# Altium schematic sheet cricket-node-hw--top-level_B.SchDoc
size D; SheetNumber: 1; SheetTotal: 1
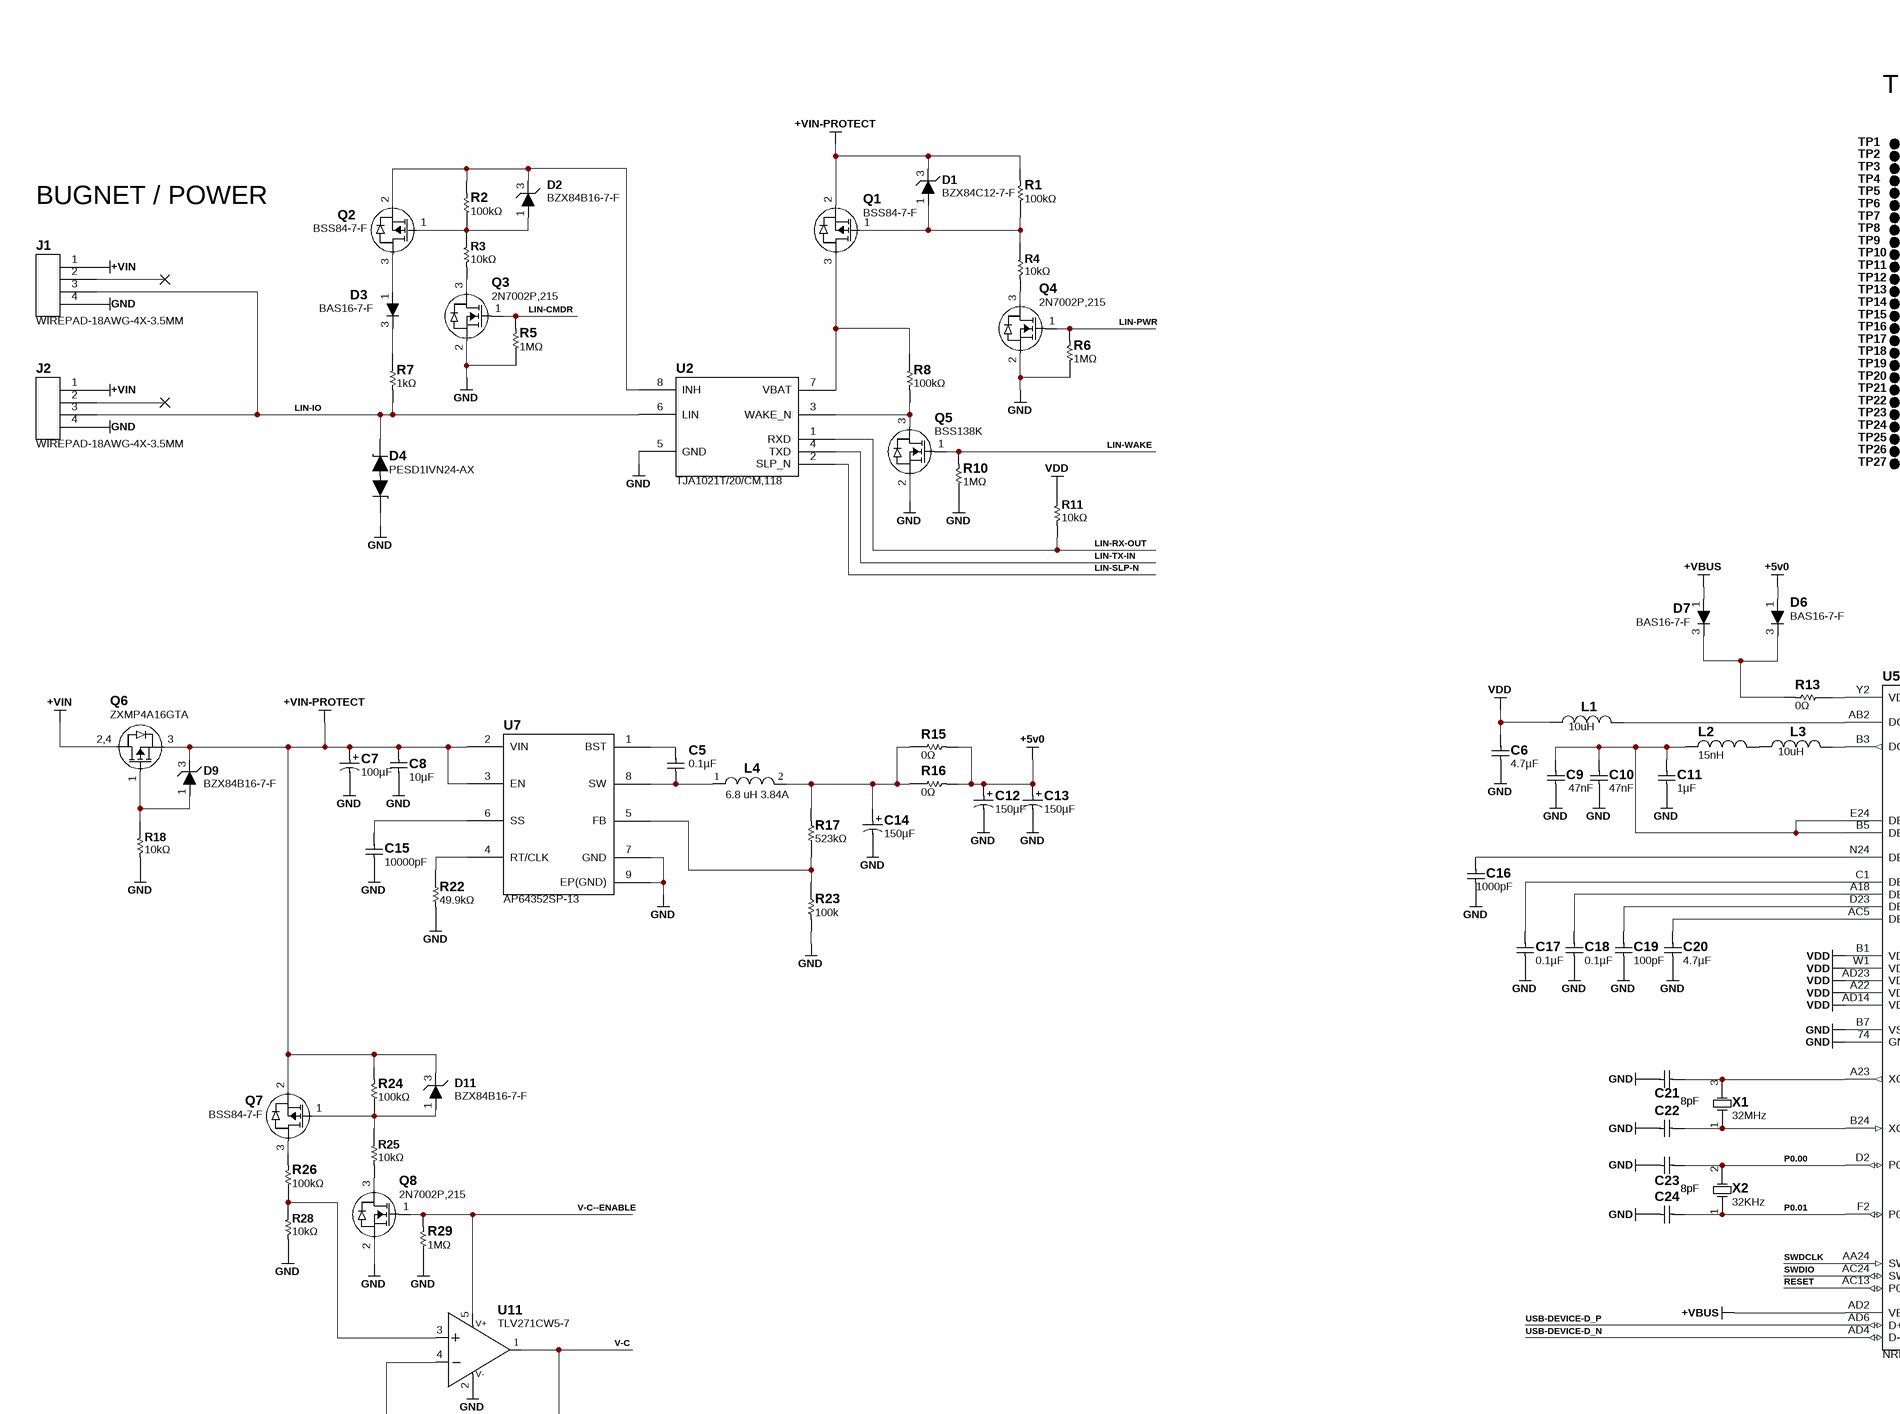
[diagram p0: cricket-node-hw--top-level_B.SchDoc, top left]
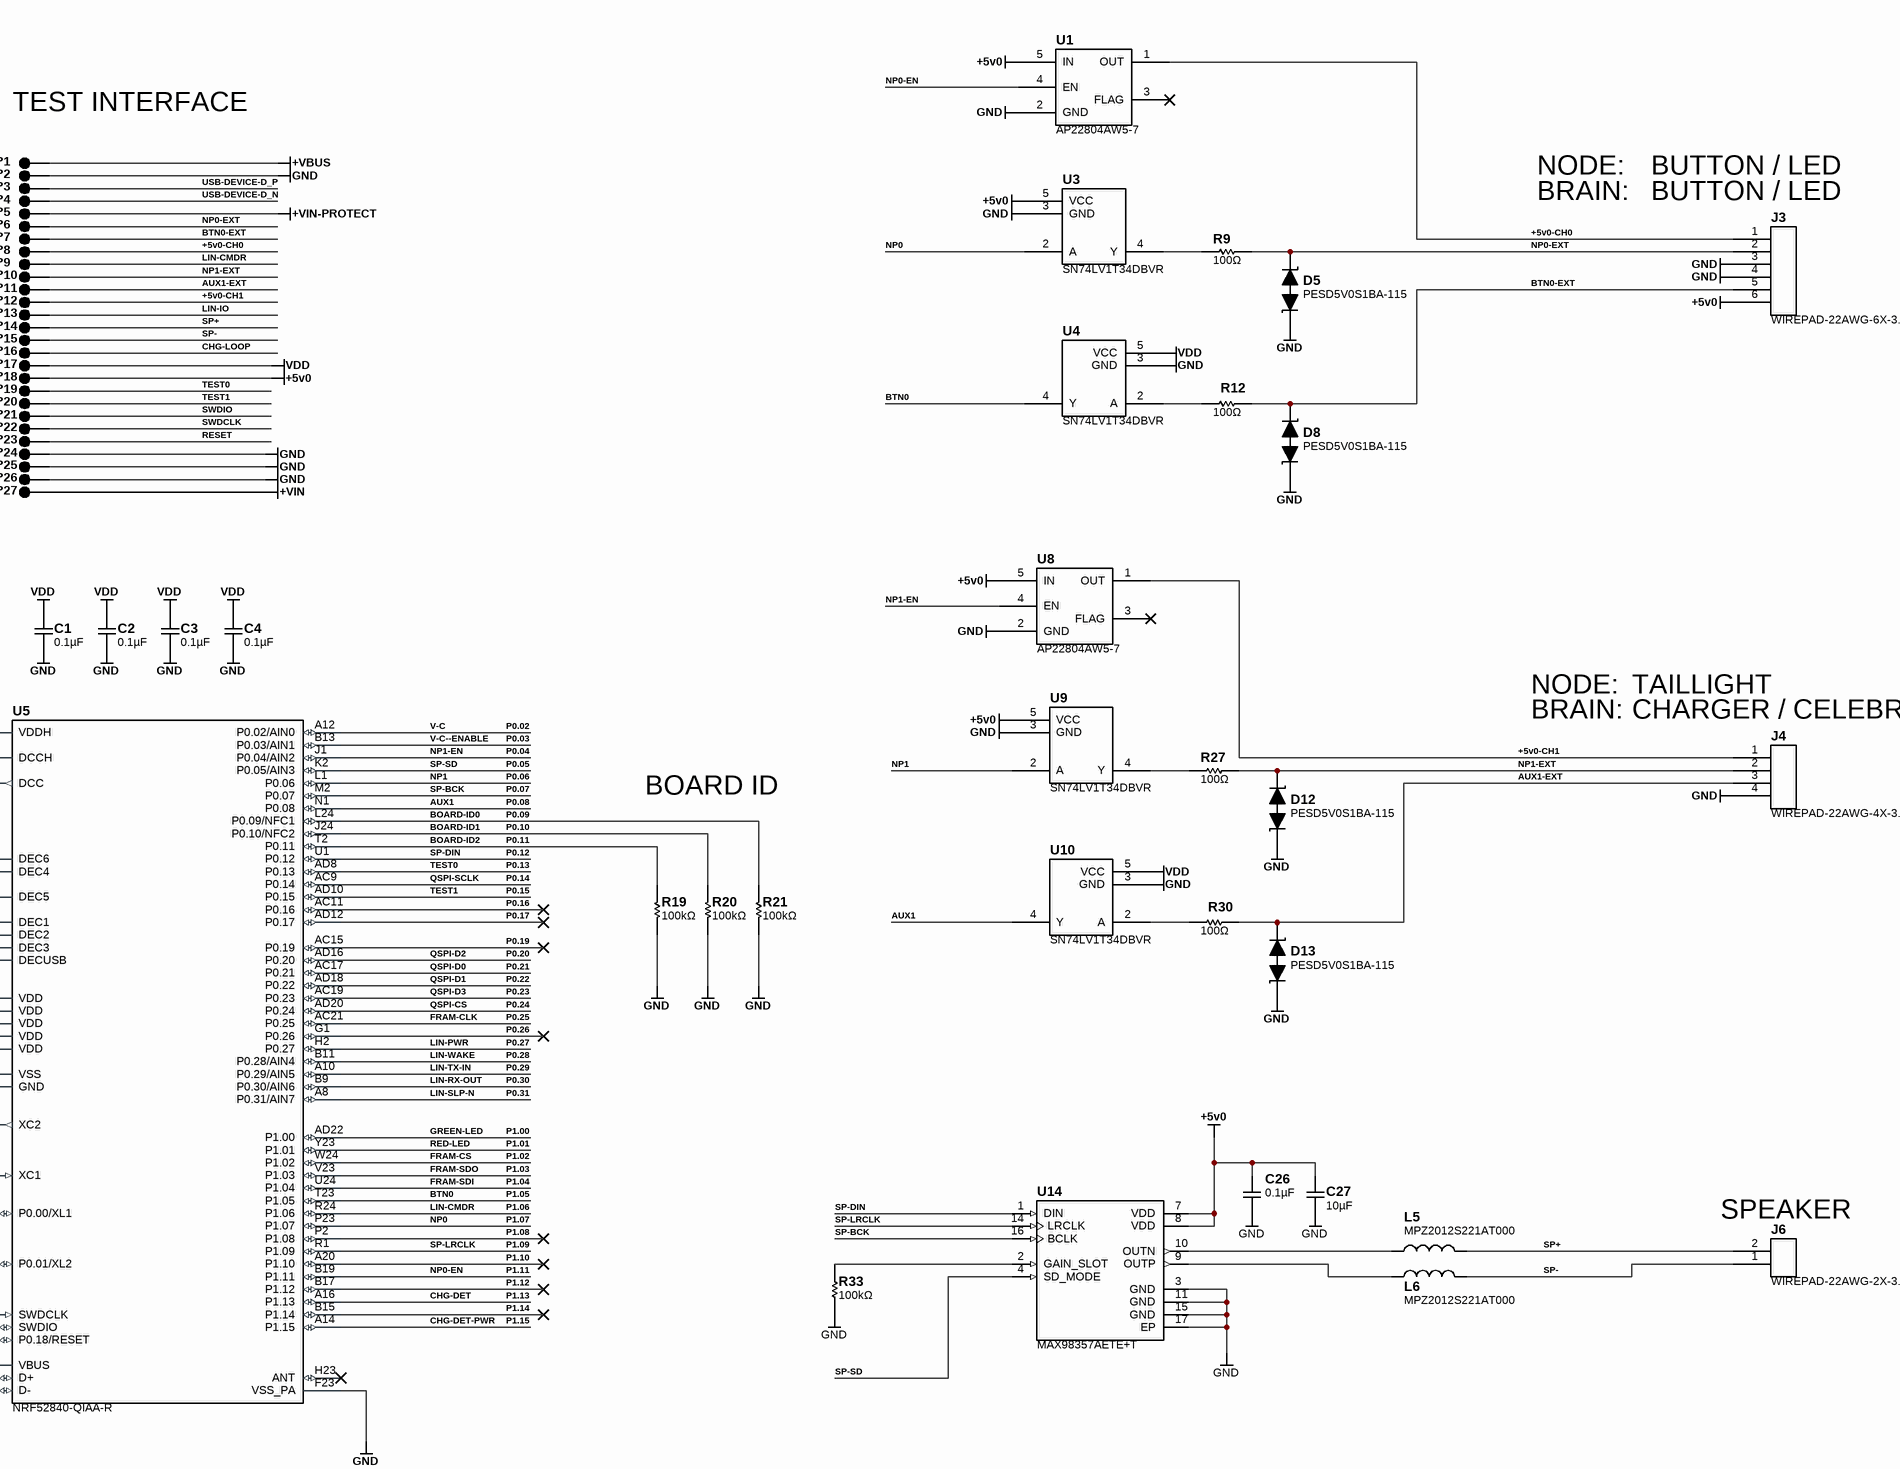
[diagram p1: cricket-node-hw--top-level_B.SchDoc, top right]
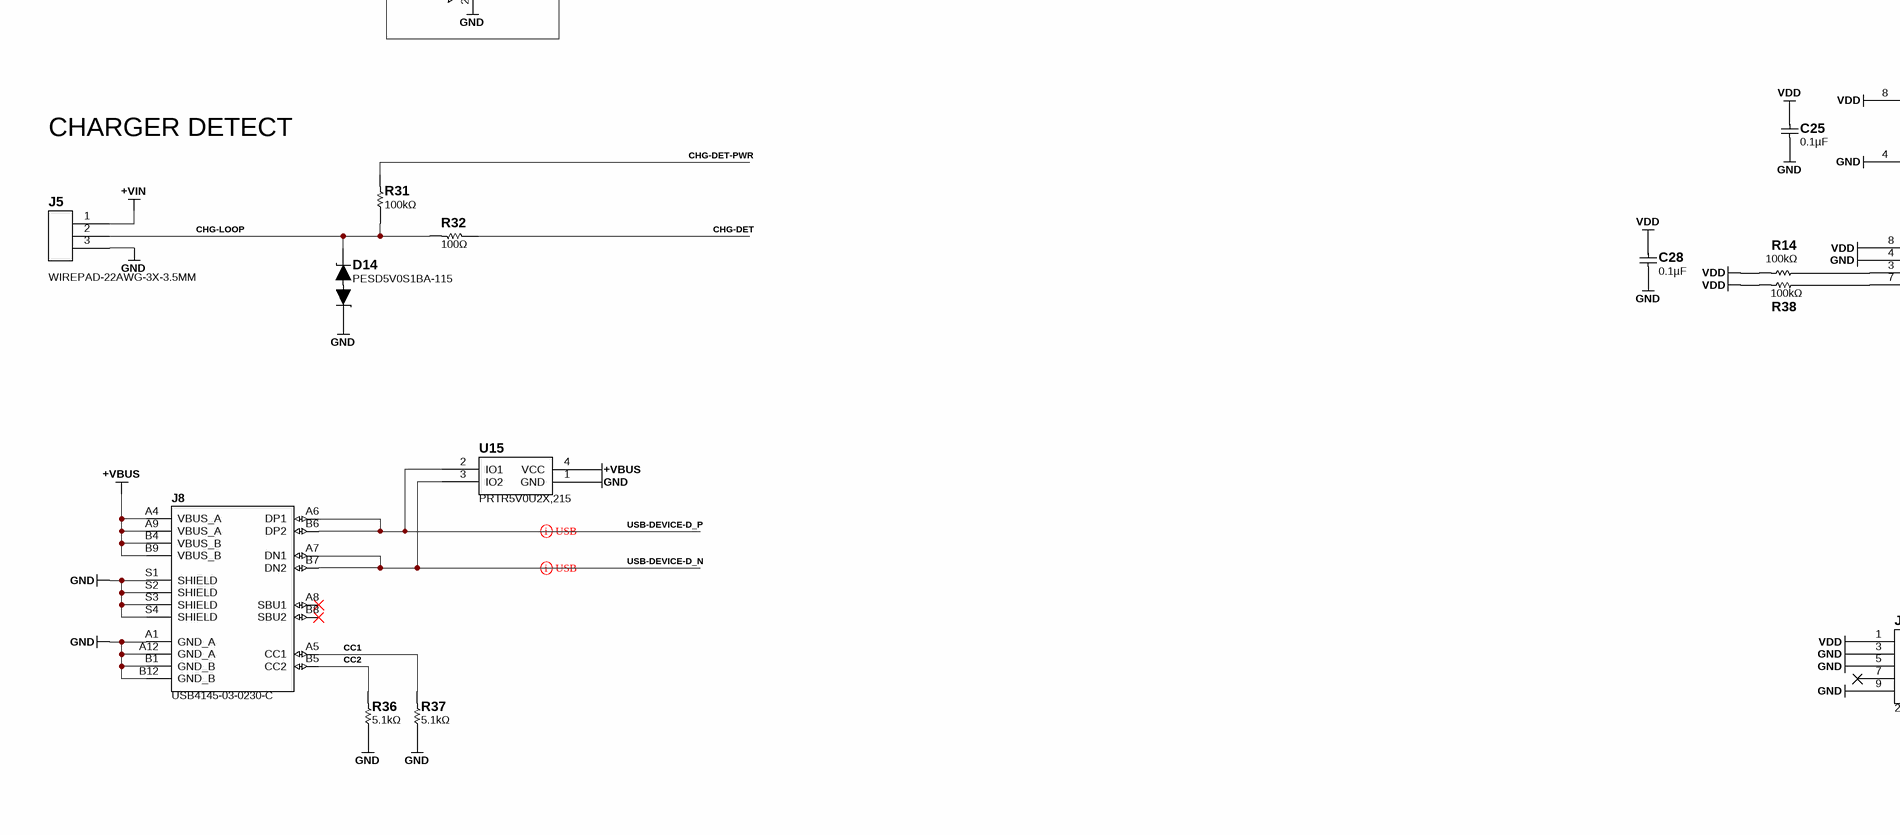
[diagram p2: cricket-node-hw--top-level_B.SchDoc, bottom left]
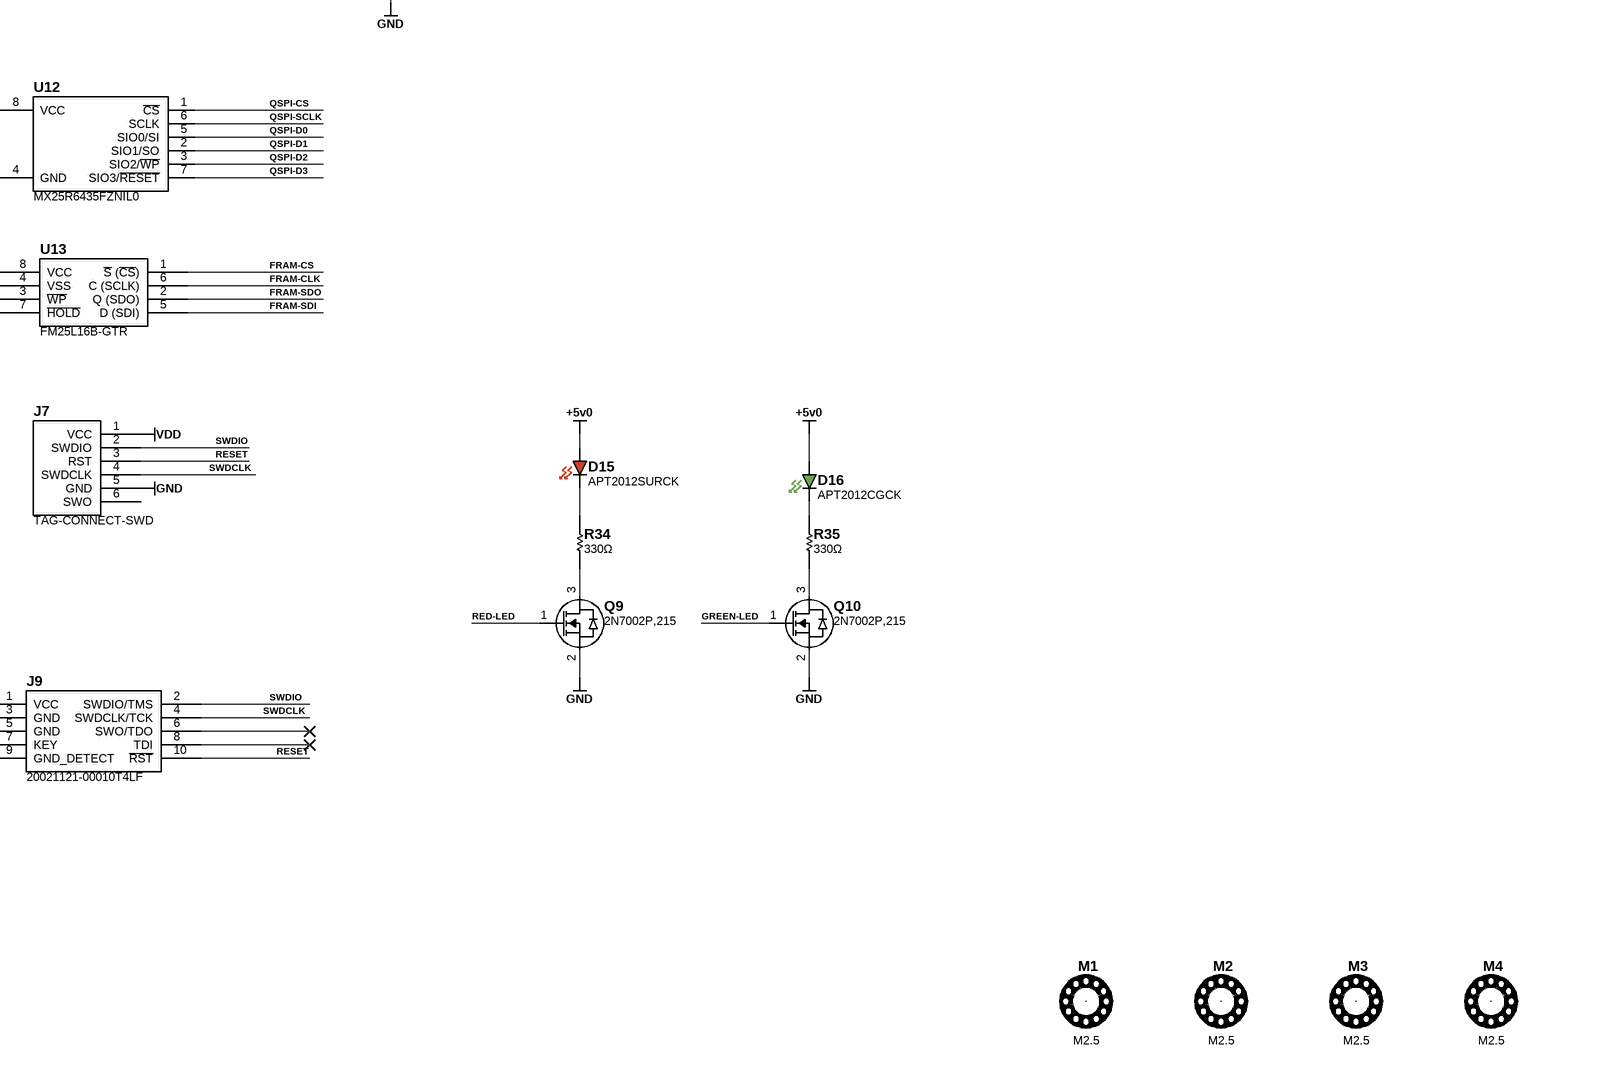
[diagram p3: cricket-node-hw--top-level_B.SchDoc, bottom right]

## Parts
C1  0.1µF  [C0402_0.55MM_HD]
C2  0.1µF  [C0402_0.55MM_HD]
C3  0.1µF  [C0402_0.55MM_HD]
C4  0.1µF  [C0402_0.55MM_HD]
C5  0.1µF  [C0603_0.90MM_MD]
C6  4.7µF  [C0805_1.40MM_MD]
C7  100µF  [C_ALU_F]
C8  10µF  [C1210_2.80MM_MD]
C9  47nF  [C0402_0.55MM_HD]
C10  47nF  [C0402_0.55MM_HD]
C11  1µF  [C0603_0.90MM_HD]
C12  150µF  [C_ALU_D]
C13  150µF  [C_ALU_D]
C14  150µF  [C_ALU_D]
C15  10000pF  [C0603_0.90MM_MD]
C16  1000pF  [C0402_0.55MM_HD]
C17  0.1µF  [C0402_0.55MM_HD]
C18  0.1µF  [C0402_0.55MM_HD]
C19  100pF  [C0402_0.55MM_HD]
C20  4.7µF  [C0805_1.40MM_MD]
C21  8pF  [C0402_0.55MM_HD]
C22  8pF  [C0402_0.55MM_HD]
C23  8pF  [C0402_0.55MM_HD]
C24  8pF  [C0402_0.55MM_HD]
C25  0.1µF  [C0603_0.90MM_MD]
C26  0.1µF  [C0603_0.90MM_MD]
C27  10µF  [C0805_1.40MM_MD]
C28  0.1µF  [C0603_0.90MM_MD]
D1  BZX84C12-7-F  [D_SOT-23-3_P]
D2  BZX84B16-7-F  [D_SOT-23-3_P]
D3  BAS16-7-F  [D_SOT-23-3_P]
D4  PESD1IVN24-AX  [D_SOD-323_P]
D5  PESD5V0S1BA-115  [D_SOD-323_P]
D6  BAS16-7-F  [D_SOT-23-3_P]
D7  BAS16-7-F  [D_SOT-23-3_P]
D8  PESD5V0S1BA-115  [D_SOD-323_P]
D9  BZX84B16-7-F  [D_SOT-23-3_P]
D11  BZX84B16-7-F  [D_SOT-23-3_P]
D12  PESD5V0S1BA-115  [D_SOD-323_P]
D13  PESD5V0S1BA-115  [D_SOD-323_P]
D14  PESD5V0S1BA-115  [D_SOD-323_P]
D15  APT2012SURCK  [LED-0805-RED]
D16  APT2012CGCK  [LED-0805-GREEN]
J1  WIREPAD-18AWG-4X-3.5MM  [WIREPAD-18AWG-4X-3.5MM]  (no BOM)
J2  WIREPAD-18AWG-4X-3.5MM  [WIREPAD-18AWG-4X-3.5MM]  (no BOM)
J3  WIREPAD-22AWG-6X-3.5MM  [WIREPAD-22AWG-6X-3.5MM]  (no BOM)
J4  WIREPAD-22AWG-4X-3.5MM  [WIREPAD-22AWG-4X-3.5MM]  (no BOM)
J5  WIREPAD-22AWG-3X-3.5MM  [WIREPAD-22AWG-3X-3.5MM]  (no BOM)
J6  WIREPAD-22AWG-2X-3.5MM  [WIREPAD-22AWG-2X-3.5MM]  (no BOM)
J7  TAG-CONNECT-SWD  [TC2030]  (no BOM)
J8  USB4145-03-0230-C  [USB4145-03-0230-C]
J9  20021121-00010T4LF  [FTSH-105-05-F-DV]
L1  10uH  [C0603_0.90MM_MD]
L2  15nH  [C0402_0.55MM_MD]
L3  10uH  [C0603_0.90MM_MD]
L4  6.8 uH 3.84A  [L_MSS1038]
L5  MPZ2012S221AT000  [L0805_1.45MM_MD]
L6  MPZ2012S221AT000  [L0805_1.45MM_MD]
M1  M2.5  [M2.5]  (no BOM)
M2  M2.5  [M2.5]  (no BOM)
M3  M2.5  [M2.5]  (no BOM)
M4  M2.5  [M2.5]  (no BOM)
Q1  BSS84-7-F  [SOT-23]
Q2  BSS84-7-F  [SOT-23]
Q3  2N7002P,215  [SOT-23]
Q4  2N7002P,215  [SOT-23]
Q5  BSS138K  [SOT-23]
Q6  ZXMP4A16GTA  [SOT223]
Q7  BSS84-7-F  [SOT-23]
Q8  2N7002P,215  [SOT-23]
Q9  2N7002P,215  [SOT-23]
Q10  2N7002P,215  [SOT-23]
R1  100kΩ  [R0603_0.55MM_MD]
R2  100kΩ  [R0603_0.55MM_MD]
R3  10kΩ  [R0603_0.55MM_MD]
R4  10kΩ  [R0603_0.55MM_MD]
R5  1MΩ  [R0603_0.55MM_MD]
R6  1MΩ  [R0603_0.55MM_MD]
R7  1kΩ  [R0603_0.55MM_MD]
R8  100kΩ  [R0603_0.55MM_MD]
R9  100Ω  [R0603_0.55MM_MD]
R10  1MΩ  [R0603_0.55MM_MD]
R11  10kΩ  [R0603_0.55MM_MD]
R12  100Ω  [R0603_0.55MM_MD]
R13  0Ω  [R0805_0.70MM_HD]
R14  100kΩ  [R0603_0.55MM_MD]
R15  0Ω  [R0805_0.70MM_HD]
R16  0Ω  [R0805_0.70MM_HD]
R17  523kΩ  [R0603_0.55MM_MD]
R18  10kΩ  [R0603_0.55MM_MD]
R19  100kΩ  [R0603_0.55MM_MD]
R20  100kΩ  [R0603_0.55MM_MD]
R21  100kΩ  [R0603_0.55MM_MD]
R22  49.9kΩ  [R0603_0.55MM_MD]
R23  100k  [R0603_0.55MM_MD]
R24  100kΩ  [R0603_0.55MM_MD]
R25  10kΩ  [R0603_0.55MM_MD]
R26  100kΩ  [R0603_0.55MM_MD]
R27  100Ω  [R0603_0.55MM_MD]
R28  10kΩ  [R0603_0.55MM_MD]
R29  1MΩ  [R0603_0.55MM_MD]
R30  100Ω  [R0603_0.55MM_MD]
R31  100kΩ  [R0603_0.55MM_MD]
R32  100Ω  [R0603_0.55MM_MD]
R33  100kΩ  [R0603_0.55MM_MD]
R34  330Ω  [R0603_0.55MM_HD]
R35  330Ω  [R0603_0.55MM_HD]
R36  5.1kΩ  [R0603_0.55MM_MD]
R37  5.1kΩ  [R0603_0.55MM_MD]
R38  100kΩ  [R0603_0.55MM_MD]
TP1  SMT Testpoint 1MM  [SMT_TP-1MM-OCTAGON]  (value not drawn)  (no BOM)
TP2  SMT Testpoint 1MM  [SMT_TP-1MM-OCTAGON]  (value not drawn)  (no BOM)
TP3  SMT Testpoint 1MM  [SMT_TP-1MM-ROUNDED-RECT]  (value not drawn)  (no BOM)
TP4  SMT Testpoint 1MM  [SMT_TP-1MM-ROUNDED-RECT]  (value not drawn)  (no BOM)
TP5  SMT Testpoint 1MM  [SMT_TP-1MM]  (value not drawn)  (no BOM)
TP6  SMT Testpoint 1MM  [SMT_TP-1MM]  (value not drawn)  (no BOM)
TP7  SMT Testpoint 1MM  [SMT_TP-1MM]  (value not drawn)  (no BOM)
TP8  SMT Testpoint 1MM  [SMT_TP-1MM]  (value not drawn)  (no BOM)
TP9  SMT Testpoint 1MM  [SMT_TP_OBROUND]  (value not drawn)  (no BOM)
TP10  SMT Testpoint 1MM  [SMT_TP-CHAMFERED-RECT]  (value not drawn)  (no BOM)
TP11  SMT Testpoint 1MM  [SMT_TP-1MM]  (value not drawn)  (no BOM)
TP12  SMT Testpoint 1MM  [SMT_TP-1MM]  (value not drawn)  (no BOM)
TP13  SMT Testpoint 1MM  [SMT_TP-1MM-ROUNDED-RECT]  (value not drawn)  (no BOM)
TP14  SMT Testpoint 1MM  [SMT_TP-1MM]  (value not drawn)  (no BOM)
TP15  SMT Testpoint 1MM  [SMT_TP-1MM]  (value not drawn)  (no BOM)
TP16  SMT Testpoint 1MM  [SMT_TP-1MM-RECT]  (value not drawn)  (no BOM)
TP17  SMT Testpoint 1MM  [SMT_TP-1MM]  (value not drawn)  (no BOM)
TP18  SMT Testpoint 1MM  [SMT_TP-1MM-RECT]  (value not drawn)  (no BOM)
TP19  SMT Testpoint 1MM  [SMT_TP-1MM]  (value not drawn)  (no BOM)
TP20  SMT Testpoint 1MM  [SMT_TP-1MM]  (value not drawn)  (no BOM)
TP21  SMT Testpoint 1MM  [SMT_TP-1MM]  (value not drawn)  (no BOM)
TP22  SMT Testpoint 1MM  [SMT_TP-1MM]  (value not drawn)  (no BOM)
TP23  SMT Testpoint 1MM  [SMT_TP-1MM]  (value not drawn)  (no BOM)
TP24  SMT Testpoint 1MM  [SMT_TP-1MM]  (value not drawn)  (no BOM)
TP25  SMT Testpoint 1MM  [SMT_TP-1MM]  (value not drawn)  (no BOM)
TP26  SMT Testpoint 1MM  [SMT_TP-1MM]  (value not drawn)  (no BOM)
TP27  SMT Testpoint 1MM  [SMT_TP-1MM]  (value not drawn)  (no BOM)
U1  AP22804AW5-7  [SOT23-5]
U2  TJA1021T/20/CM,118  [SOIC127P600X175-8N]
U3  SN74LV1T34DBVR  [SOT23-5]
U4  SN74LV1T34DBVR  [SOT23-5]
U5  NRF52840-QIAA-R  [AQFN50P700X700X85_HS-74N]
U7  AP64352SP-13  [SO8-EP]
U8  AP22804AW5-7  [SOT23-5]
U9  SN74LV1T34DBVR  [SOT23-5]
U10  SN74LV1T34DBVR  [SOT23-5]
U11  TLV271CW5-7  [sot23-5]
U12  MX25R6435FZNIL0  [SON127P600X80_HS-9N]
U13  FM25L16B-GTR  [SOIC 8]
U14  MAX98357AETE+T  [QFN50P300X300X80_HS-17N-2]
U15  PRTR5V0U2X,215  [SOT143B]
X1  32MHz  [XTAL_2016]
X2  32KHz  [XTAL_3215]

## Nets
+5v0: C12.1 C13.1 C26.2 C27.2 D6.1(A) D15.A D16.A J3.6 R15.2 R16.2 TP18.1 U1.5(IN) U3.5(VCC) U8.5(IN) U9.5(VCC) U14.7(VDD) U14.8(VDD)
+VBUS: D7.1(A) J8.A4(VBUS_A) J8.A9(VBUS_A) J8.B4(VBUS_B) J8.B9(VBUS_B) TP1.1 U5.AD2(VBUS) U15.4(VCC)
+VIN: J1.1 J2.1 J5.1 Q6.2,4(D) TP27.1
+VIN-PROTECT: C7.1 C8.1 D1.3(K) D9.3(K) D11.3(K) Q1.2(S) Q6.3(S) Q7.2(S) R1.2 R24.2 TP5.1 U7.2(VIN) U7.3(EN)
GND: C1.1 C2.1 C3.1 C4.1 C6.1 C7.2 C8.2 C9.1 C10.1 C11.1 C12.2 C13.2 C14.2 C15.1 C16.1 C17.1 C18.1 C19.1 C20.1 C21.2 C22.2 C23.1 C24.1 C25.1 C26.1 C27.1 C28.1 D4.1(C) D5.1(C) D8.1(C) D12.1(C) D13.1(C) D14.1(C) J1.4 J2.4 J3.3 J3.4 J4.4 J5.3 J7.5(GND) J8.A1(GND_A) J8.A12(GND_A) J8.B1(GND_B) J8.B12(GND_B) J8.S1(SHIELD) J8.S2(SHIELD) J8.S3(SHIELD) J8.S4(SHIELD) J9.3(GND) J9.5(GND) J9.9(GND_DETECT) Q3.2(S) Q4.2(S) Q5.2(S) Q8.2(S) Q9.2(S) Q10.2(S) R5.1 R6.1 R10.1 R18.2 R19.1 R20.1 R21.1 R22.2 R23.2 R28.2 R29.1 R33.2 R36.1 R37.1 TP2.1 TP24.1 TP25.1 TP26.1 U1.2(GND) U2.5(GND) U3.3(GND) U4.3(GND) U5.74(GND) U5.B7(VSS) U5.F23(VSS_PA) U7.7(GND) U7.9(EP(GND)) U8.2(GND) U9.3(GND) U10.3(GND) U11.2(GND) U12.4(GND) U12.9(GND) U13.4(VSS) U14.3(GND) U14.11(GND) U14.15(GND) U14.17(EP) U15.1(GND)
VDD: C1.2 C2.2 C3.2 C4.2 C6.2 C25.2 C28.2 J7.1(VCC) J9.1(VCC) L1.1 R11.1 R14.2 R38.2 TP17.1 U4.5(VCC) U5.A22(VDD) U5.AD14(VDD) U5.AD23(VDD) U5.B1(VDD) U5.W1(VDD) U10.5(VCC) U12.8(VCC) U13.8(VCC)
+5v0-CH0: J3.1 TP8.1 U1.1(OUT)
+5v0-CH1: J4.1 TP12.1 U8.1(OUT)
AUX1: U5.N1(P0.08) U10.4(Y)  [also labelled P0.08]
AUX1-EXT: D13.2(C) J4.3 R30.2 TP11.1
BOARD-ID0: R21.2 U5.L24(P0.09/NFC1)  [also labelled P0.09]
BOARD-ID1: R20.2 U5.J24(P0.10/NFC2)  [also labelled P0.10]
BOARD-ID2: R19.2 U5.T2(P0.11)  [also labelled P0.11]
BTN0: U4.4(Y) U5.T23(P1.05)  [also labelled P1.05]
BTN0-EXT: D8.2(C) J3.5 R12.2 TP7.1
CC1: J8.A5(CC1) R37.2
CC2: J8.B5(CC2) R36.2
CHG-DET: R32.1 U5.A16(P1.13)  [also labelled P1.13]
CHG-DET-PWR: R31.2 U5.A14(P1.15)  [also labelled P1.15]
CHG-LOOP: D14.2(C) J5.2 R31.1 R32.2 TP16.1
FRAM-CLK: U5.AC21(P0.25) U13.6(C_(SCLK))  [also labelled P0.25]
FRAM-CS: U5.W24(P1.02) U13.1(~{S}_(~{CS}))  [also labelled P1.02]
FRAM-SDI: U5.U24(P1.04) U13.5(D_(SDI))  [also labelled P1.04]
FRAM-SDO: U5.V23(P1.03) U13.2(Q_(SDO))  [also labelled P1.03]
GREEN-LED: Q10.1(G) U5.AD22(P1.00)  [also labelled P1.00]
LIN-CMDR: Q3.1(G) R5.2 TP9.1 U5.R24(P1.06)  [also labelled P1.06]
LIN-IO: D4.2(C) J1.3 J2.3 R7.2 TP13.1 U2.6(LIN)
LIN-PWR: Q4.1(G) R6.2 U5.H2(P0.27)  [also labelled P0.27]
LIN-RX-OUT: R11.2 U2.1(RXD) U5.B9(P0.30/AIN6)  [also labelled P0.30]
LIN-SLP-N: U2.2(SLP_N) U5.A8(P0.31/AIN7)  [also labelled P0.31]
LIN-TX-IN: U2.4(TXD) U5.A10(P0.29/AIN5)  [also labelled P0.29]
LIN-WAKE: Q5.1(G) R10.2 U5.B11(P0.28/AIN4)  [also labelled P0.28]
NP0: U3.2(A) U5.P23(P1.07)  [also labelled P1.07]
NP0-EN: U1.4(EN) U5.B19(P1.11)  [also labelled P1.11]
NP0-EXT: D5.2(C) J3.2 R9.2 TP6.1
NP1: U5.L1(P0.06) U9.2(A)  [also labelled P0.06]
NP1-EN: U5.J1(P0.04/AIN2) U8.4(EN)  [also labelled P0.04]
NP1-EXT: D12.2(C) J4.2 R27.2 TP10.1
P0.00: C23.2 U5.D2(P0.00/XL1) X2.2(OSC2)
P0.01: C24.2 U5.F2(P0.01/XL2) X2.1(OSC1)
P0.02: U5.A12(P0.02/AIN0) U11.1(OUT) U11.4(-)  [also labelled V-C]
P0.03: Q8.1(G) R29.2 U5.B13(P0.03/AIN1) U11.5(VCC)  [also labelled V-C--ENABLE]
P0.05: U5.K2(P0.05/AIN3) U14.4(SD_MODE)  [also labelled SP-SD]
P0.07: U5.M2(P0.07) U14.16(BCLK)  [also labelled SP-BCK]
P0.12: U5.U1(P0.12) U14.1(DIN)  [also labelled SP-DIN]
P0.13: TP19.1 U5.AD8(P0.13)  [also labelled TEST0]
P0.14: U5.AC9(P0.14) U12.6(SCLK)  [also labelled QSPI-SCLK]
P0.15: TP20.1 U5.AD10(P0.15)  [also labelled TEST1]
P0.16: U5.AC11(P0.16)
P0.17: U5.AD12(P0.17)
P0.19: U5.AC15(P0.19)
P0.20: U5.AD16(P0.20) U12.3(SIO2/~{WP})  [also labelled QSPI-D2]
P0.21: U5.AC17(P0.21) U12.5(SIO0/SI)  [also labelled QSPI-D0]
P0.22: U5.AD18(P0.22) U12.2(SIO1/SO)  [also labelled QSPI-D1]
P0.23: U5.AC19(P0.23) U12.7(SIO3/~{RESET})  [also labelled QSPI-D3]
P0.24: U5.AD20(P0.24) U12.1(~{CS})  [also labelled QSPI-CS]
P0.26: U5.G1(P0.26)
P1.01: Q9.1(G) U5.Y23(P1.01)  [also labelled RED-LED]
P1.08: U5.P2(P1.08)
P1.09: U5.R1(P1.09) U14.14(LRCLK)  [also labelled SP-LRCLK]
P1.10: U5.A20(P1.10)
P1.12: U5.B17(P1.12)
P1.14: U5.B15(P1.14)
RESET: J7.3(RST) J9.10(~{RST}) TP23.1 U5.AC13(P0.18/RESET)
SP+: J6.2 L5.2 TP14.1
SP-: J6.1 L6.2 TP15.1
SWDCLK: J7.4(SWDCLK) J9.4(SWDCLK/TCK) TP22.1 U5.AA24(SWDCLK)
SWDIO: J7.2(SWDIO) J9.2(SWDIO/TMS) TP21.1 U5.AC24(SWDIO)
USB-DEVICE-D_N: J8.A7(DN1) J8.B7(DN2) TP4.1 U5.AD4(D-) U15.3(IO2)
USB-DEVICE-D_P: J8.A6(DP1) J8.B6(DP2) TP3.1 U5.AD6(D+) U15.2(IO1)
NetC5_1: C5.1 L4.1 U7.8(SW)
NetC5_2: C5.2 U7.1(BST)
NetC9_2: C9.2 C10.2 C11.2 L2.1 U5.B5(DEC4) U5.E24(DEC6)
NetC14_1: C14.1 L4.2 R15.1 R16.1 R17.2
NetC15_2: C15.2 U7.6(SS)
NetC16_2: C16.2 U5.N24(DEC5)
NetC17_2: C17.2 U5.C1(DEC1)
NetC18_2: C18.2 U5.A18(DEC2)
NetC19_2: C19.2 U5.D23(DEC3)
NetC20_2: C20.2 U5.AC5(DECUSB)
NetC21_1: C21.1 U5.A23(XC2) X1.3(OSC3)
NetC22_1: C22.1 U5.B24(XC1) X1.1(OSC1)
NetD1_1: D1.1(A) Q1.1(G) R1.1 R4.1
NetD2_1: D2.1(A) Q2.1(G) R2.1 R3.1
NetD2_3: D2.3(K) Q2.2(S) R2.2 U2.8(INH)
NetD3_1: D3.1(A) Q2.3(D)
NetD3_3: D3.3(K) R7.1
NetD6_3: D6.3(K) D7.3(K) R13.2
NetD9_1: D9.1(A) Q6.1(G) R18.1
NetD11_1: D11.1(A) Q7.1(G) R24.1 R25.1
NetD15_C: D15.C R34.2
NetD16_C: D16.C R35.2
NetL1_2: L1.2 U5.AB2(DCCH)
NetL2_2: L2.2 L3.1
NetL3_2: L3.2 U5.B3(DCC)
NetL5_1: L5.1 U14.10(OUTN)
NetL6_1: L6.1 U14.9(OUTP)
NetQ1_3: Q1.3(D) R8.1 U2.7(VBAT)
NetQ3_3: Q3.3(D) R3.2
NetQ4_3: Q4.3(D) R4.2
NetQ5_3: Q5.3(D) R8.2 U2.3(WAKE_N)
NetQ7_3: Q7.3(D) R26.2
NetQ8_3: Q8.3(D) R25.2
NetQ9_3: Q9.3(D) R34.1
NetQ10_3: Q10.3(D) R35.1
NetR9_1: R9.1 U3.4(Y)
NetR12_1: R12.1 U4.2(A)
NetR13_1: R13.1 U5.Y2(VDDH)
NetR14_1: R14.1 U13.3(~{WP})
NetR17_1: R17.1 R23.1 U7.5(FB)
NetR22_1: R22.1 U7.4(RT/CLK)
NetR26_1: R26.1 R28.1 U11.3(+)
NetR27_1: R27.1 U9.4(Y)
NetR30_1: R30.1 U10.2(A)
NetR33_1: R33.1 U14.2(GAIN_SLOT)
NetR38_1: R38.1 U13.7(~{HOLD})

Not connected (* = marked no-connect by the designer): J1 2*; J2 2*; J7 6(SWO); J8 A8(SBU1)* B8(SBU2)*; J9 6(SWO/TDO)* 7(KEY)* 8(TDI)*; M1 1; M2 1; M3 1; M4 1; U1 3(FLAG)*; U5 H23(ANT)*; U8 3(FLAG)*

## Layout directives
differential pair: USB-DEVICE-D_N, USB-DEVICE-D_P

## Notes on the sheet
- TEST INTERFACE
- NODE:
- BRAIN:
- BUTTON / LED
- (near J3) BUTTON / LED
- BUGNET / POWER
- TAILLIGHT
- (near J4) CHARGER / CELEBRATION
- BOARD ID
- (near J6) SPEAKER
- CHARGER DETECT
- Part Number
- Document Type
- SCHEMATIC DRAWING
- PCB Mixdown
- CCA Mixdown
- Codename
- Engineer
- Date
- Status
- Page
- (in symbol TLV271CW5-7) V+; V-

## Library data of the parts
C1-C4 C17 C18 = GCM155R71H104KE02D: CAP CER 0.1UF 50V X7R 0402; Manufacturer: Murata Electronics; Tolerance: ±10%; Substitution Notes: 0.1µF , 50V , ±10% , X7R , -55°C ~ 125°C , AEC-Q200 , 0402; Value: 0.1µF; Temperature Coefficient: X7R; Manufacturer Part Number: GCM155R71H104KE02D; Category: Capacitors; Voltage - Rated: 50V; Operating Temperature: -55°C ~ 125°C; Ratings: AEC-Q200; Package: 0402; Thickness (Max): 0.55MM; ComponentLink1Description: Datasheet (Internal); ComponentLink1URL: https://search.murata.co.jp/Ceramy/image/img/A01X/G101/ENG/GCM155R71H104KE02-01.pdf; ComponentLink2Description: Datasheet (External); ComponentLink2URL: https://search.murata.co.jp/Ceramy/image/img/A01X/G101/ENG/GCM155R71H104KE02-01.pdf; Supplier 1: Digikey; Supplier Part Number 1: 490-10672-1-ND; JLCPCB Part #: C85858
C5 C25 C26 C28 = GCJ188R91H104KA01D: CAP CER 0.1UF 50V X8R 0603; Manufacturer: Murata Electronics; Tolerance: ±10%; Substitution Notes: 0.1µF , 50V , ±10% , X8R , -55°C ~ 150°C , AEC-Q200 , 0603; id: 2218; is_external: 1; Value: 0.1µF; Temperature Coefficient: X8R; Manufacturer Part Number: GCJ188R91H104KA01D; Category: Capacitors; Voltage - Rated: 50V; Operating Temperature: -55°C ~ 150°C; Ratings: AEC-Q200; Package: 0603; Thickness (Max): 0.90MM; JLCPCB Part #: C437421
  C5: ComponentLink1Description: Datasheet (Internal); ComponentLink1URL: https://search.murata.co.jp/Ceramy/image/img/A01X/G101/ENG/GCJ188R91H104KA01-01.pdf; ComponentLink2Description: Datasheet (External); ComponentLink2URL: https://search.murata.co.jp/Ceramy/image/img/A01X/G101/ENG/GCJ188R91H104KA01-01.pdf; Supplier 1: Digikey; Supplier Part Number 1: 490-14412-1-ND
C6 C20 = GCM21BR71C475KA73K: CAP CER 4.7UF 16V X7R 0805; Manufacturer: Murata Electronics; Tolerance: ±10%; Substitution Notes: 4.7µF , 16V , ±10% , X7R , -55°C ~ 125°C , AEC-Q200 , 0805; Value: 4.7µF; Temperature Coefficient: X7R; Manufacturer Part Number: GCM21BR71C475KA73K; Category: Capacitors; Voltage - Rated: 16V; Operating Temperature: -55°C ~ 125°C; Ratings: AEC-Q200; Package: 0805; Thickness (Max): 1.40MM; JLCPCB Part #: C2167533
C7 = EEE-FK1V101P: CAP ALUM 100UF 35V 20% SMD; Manufacturer: Panasonic Electronic Components; kicad-symbol: Capacitor:C_2P_P; kicad-footprint: C_ALU_F:C_ALU_F; Lifetime @ Temp#: 2000 Hrs @ 105°C; Ripple Current: 600mA; Impedance: 160 mOhm; Surface Mount Land Size: 0.327" L x 0.327" W (8.30mm x 8.30mm); Value_Voltage: 100µF  35V; Value: 100µF; Temperature Coefficient: Temperature Coefficient; cad-reference: EEE-FK1V101P; Manufacturer Part Number: EEE-FK1V101P; ComponentLink1Description: Internal Datasheet; ComponentLink1URL: http://industrial.panasonic.com/www-cgi/jvcr13pz.cgi?E+PZ+3+ABA0120+EEEFK1V101P+7+WW; ComponentLink2Description: External Datasheet; ComponentLink2URL: http://industrial.panasonic.com/www-cgi/jvcr13pz.cgi?E+PZ+3+ABA0120+EEEFK1V101P+7+WW; Category: Capacitors; Sort Value: 100000000; Sort Value Package: F_100000000; Capacitance: 100µF; Voltage Rating: 35V; Tolerance: ±20%; Operating Temperature: -55°C ~ 105°C; Features: General Purpose; ESR (Equivalent Series Resistance): -; Mounting Type: Surface Mount; Package / Case: Radial- Can - SMD; Size / Dimension: 0.315" Dia (8.00mm); Height - Seated (Max): 0.402" (10.20mm); Lead Spacing: -; Packaging: Cut Tape (CT); Diameter: 8.0; Height: 10.2; Package: F; Ratings: AEC-Q200
C8 = GCJ32EC71H106KA01L: CAP CER 10UF 50V X7S 1210; Manufacturer: Murata Electronics; Tolerance: ±10%; Substitution Notes: 10µF , 50V , ±10% , X7S , -55°C ~ 125°C , AEC-Q200 , 1210; id: 2462; is_external: 1; Value: 10µF; Temperature Coefficient: X7S; Manufacturer Part Number: GCJ32EC71H106KA01L; ComponentLink1Description: Datasheet (Internal); ComponentLink1URL: https://search.murata.co.jp/Ceramy/image/img/A01X/G101/ENG/GCJ32EC71H106KA01-01.pdf; ComponentLink2Description: Datasheet (External); ComponentLink2URL: https://search.murata.co.jp/Ceramy/image/img/A01X/G101/ENG/GCJ32EC71H106KA01-01.pdf; Supplier 1: Digikey; Supplier Part Number 1: 490-14418-1-ND; Category: Capacitors; Voltage - Rated: 50V; Operating Temperature: -55°C ~ 125°C; Ratings: AEC-Q200; Package: 1210; Thickness (Max): 2.80MM; JLCPCB Part #: C437431
C9 C10 = GCM155R71C473KA37D: CAP CER 0.047UF 16V X7R 0402; Manufacturer: Murata Electronics; Value: 0.047µF; Tolerance: ±10%; Substitution Notes: 0.047µF , 16V , ±10% , X7R , -55°C ~ 125°C , AEC-Q200 , 0402; Temperature Coefficient: X7R; Manufacturer Part Number: GCM155R71C473KA37D; Category: Capacitors; Voltage - Rated: 16V; Operating Temperature: -55°C ~ 125°C; Ratings: AEC-Q200; Package: 0402; Thickness (Max): 0.55MM; ComponentLink1Description: Datasheet (Internal); ComponentLink1URL: https://psearch.en.murata.com/capacitor/product/GCM155R71C473KA37%23.pdf; ComponentLink2Description: Datasheet (External); ComponentLink2URL: https://psearch.en.murata.com/capacitor/product/GCM155R71C473KA37%23.pdf; Supplier 1: Digikey; Supplier Part Number 1: 490-6042-1-ND; JLCPCB Part #: C126525
C11 = GCM188R71C105KA64J: CAP CER 1UF 16V X7R 0603; Manufacturer: Murata Electronics; Tolerance: ±10%; Substitution Notes: 1µF , 16V , ±10% , X7R , -55°C ~ 125°C , AEC-Q200 , 0603; Value: 1µF; Temperature Coefficient: X7R; Manufacturer Part Number: GCM188R71C105KA64J; Category: Capacitors; Voltage - Rated: 16V; Operating Temperature: -55°C ~ 125°C; Ratings: AEC-Q200; Package: 0603; Thickness (Max): 0.90MM; JLCPCB Part #: C2169902
C12-C14 = EEE-FK1A151P: CAP ALUM 150UF 10V 20% SMD; Manufacturer: Panasonic Electronic Components; id: 1585; is_external: 1; Impedance: 360 mOhm; Lifetime @ Temp.: 2000 Hrs @ 105°C; Surface Mount Land Size: 0.260" L x 0.260" W (6.60mm x 6.60mm); Ripple Current: 240mA; Value_Voltage: 150µF  10V; Value: 150µF; Temperature Coefficient: Temperature Coefficient; Manufacturer Part Number: EEE-FK1A151P; Sort Value: 150000000; Tolerance: ±20%; Size / Dimension: 0.248" Dia (6.30mm); ComponentLink2URL: http://industrial.panasonic.com/www-cgi/jvcr13pz.cgi?E+PZ+4+ABA0120+EEEFK1A151P+8+WW; Diameter: 6.30; Features: General Purpose; Voltage Rating: 10V; Category: Capacitors; Ratings: AEC-Q200; ESR (Equivalent Series Resistance): -; Sort Value Package: D_150000000; ComponentLink2Description: External Datasheet; ComponentLink1URL: http://industrial.panasonic.com/www-cgi/jvcr13pz.cgi?E+PZ+4+ABA0120+EEEFK1A151P+8+WW; Height: 5.80; Mounting Type: Surface Mount; Lead Spacing: -; Package: D; Operating Temperature: -55°C ~ 105°C; Height - Seated (Max): 0.228" (5.80mm); ComponentLink1Description: Internal Datasheet; Package / Case: Radial- Can - SMD; Packaging: Cut Tape (CT); Capacitance: 150µF; JLCPCB Part #: C264054
C15 = GCM188R72A103KA37J: CAP CER 10000PF 100V X7R 0603; Manufacturer: Murata Electronics; Tolerance: ±10%; Substitution Notes: 10000pF , 100V , ±10% , X7R , -55°C ~ 125°C , AEC-Q200 , 0603; id: 2095; is_external: 1; Value: 10000pF; Temperature Coefficient: X7R; Manufacturer Part Number: GCM188R72A103KA37J; Category: Capacitors; Voltage - Rated: 100V; Operating Temperature: -55°C ~ 125°C; Ratings: AEC-Q200; Package: 0603; Thickness (Max): 0.90MM; JLCPCB Part #: C2167085
C16 = GCM1555C1H102FA16D: CAP CER 1000PF 50V C0G/NP0 0402; Manufacturer: Murata Electronics; Temperature Coefficient: C0G, NP0; Tolerance: ±1%; Substitution Notes: 1000pF , 50V , ±1% , C0G, NP0 , -55°C ~ 125°C , AEC-Q200 , 0402; Value: 1000pF; Manufacturer Part Number: GCM1555C1H102FA16D; Category: Capacitors; Voltage - Rated: 50V; Operating Temperature: -55°C ~ 125°C; Ratings: AEC-Q200; Package: 0402; Thickness (Max): 0.55MM; ComponentLink1Description: Datasheet (Internal); ComponentLink1URL: https://search.murata.co.jp/Ceramy/image/img/A01X/G101/ENG/GCM1555C1H102FA16-01.pdf; ComponentLink2Description: Datasheet (External); ComponentLink2URL: https://search.murata.co.jp/Ceramy/image/img/A01X/G101/ENG/GCM1555C1H102FA16-01.pdf; Supplier 1: Digikey; Supplier Part Number 1: 490-16461-1-ND
C19 = GCM1555C1H101FA16D: CAP CER 100PF 50V C0G/NP0 0402; Manufacturer: Murata Electronics; Temperature Coefficient: C0G, NP0; Tolerance: ±1%; Substitution Notes: 100pF , 50V , ±1% , C0G, NP0 , -55°C ~ 125°C , AEC-Q200 , 0402; Value: 100pF; Manufacturer Part Number: GCM1555C1H101FA16D; Category: Capacitors; Voltage - Rated: 50V; Operating Temperature: -55°C ~ 125°C; Ratings: AEC-Q200; Package: 0402; Thickness (Max): 0.55MM; ComponentLink1Description: Datasheet (Internal); ComponentLink1URL: https://search.murata.co.jp/Ceramy/image/img/A01X/G101/ENG/GCM1555C1H101FA16-01.pdf; ComponentLink2Description: Datasheet (External); ComponentLink2URL: https://search.murata.co.jp/Ceramy/image/img/A01X/G101/ENG/GCM1555C1H101FA16-01.pdf; Supplier 1: Digikey; Supplier Part Number 1: 490-14349-1-ND; JLCPCB Part #: C2941926
C21-C24 = GCM1555C1H8R0DA16D: CAP CER 8PF 50V C0G/NP0 0402; Manufacturer: Murata Electronics; Temperature Coefficient: C0G, NP0; Tolerance: ±0.5pF; Substitution Notes: 8pF , 50V , ±0.5pF , C0G, NP0 , -55°C ~ 125°C , AEC-Q200 , 0402; Value: 8pF; Manufacturer Part Number: GCM1555C1H8R0DA16D; Category: Capacitors; Voltage - Rated: 50V; Operating Temperature: -55°C ~ 125°C; Ratings: AEC-Q200; Package: 0402; Thickness (Max): 0.55MM; ComponentLink1Description: Datasheet (Internal); ComponentLink1URL: https://www.murata.com/~/media/webrenewal/support/library/catalog/products/capacitor/mlcc/c03e.ashx?la=en-us; ComponentLink2Description: Datasheet (External); ComponentLink2URL: https://www.murata.com/~/media/webrenewal/support/library/catalog/products/capacitor/mlcc/c03e.ashx?la=en-us; Supplier 1: Digikey; Supplier Part Number 1: 490-13294-1-ND; JLCPCB Part #: C126517
C27 = GCM21BR71A106KE22K: CAP CER 10UF 10V X7R 0805; Manufacturer: Murata Electronics; Tolerance: ±10%; Substitution Notes: 10µF , 10V , ±10% , X7R , -55°C ~ 125°C , AEC-Q200 , 0805; id: 2281; is_external: 1; Value: 10µF; Temperature Coefficient: X7R; Manufacturer Part Number: GCM21BR71A106KE22K; ComponentLink1Description: Datasheet (Internal); ComponentLink1URL: https://search.murata.co.jp/Ceramy/image/img/A01X/G101/ENG/GCM21BR71A106KE22-01.pdf; ComponentLink2Description: Datasheet (External); ComponentLink2URL: https://search.murata.co.jp/Ceramy/image/img/A01X/G101/ENG/GCM21BR71A106KE22-01.pdf; Supplier 1: Digikey; Supplier Part Number 1: 490-14531-1-ND; Category: Capacitors; Voltage - Rated: 10V; Operating Temperature: -55°C ~ 125°C; Ratings: AEC-Q200; Package: 0805; Thickness (Max): 1.40MM; JLCPCB Part #: C2167756
D1 = BZX84C12-7-F: DIODE ZENER 12V 300MW SOT23-3; Manufacturer: Diodes Inc; CategorySort: 400; Voltage - Forward (Vf) (Max) @ If: 900mV @ 10mA; Current - Reverse Leakage @ Vr: 100nA @ 8V; Tolerance: ±5%; Impedance (Max) (Zzt): 25 Ohm; Num Pins: 3; Diode Suffix: 1A_3C; kicad-symbol: Diode:DZ_1A_3C; kicad-footprint: D_SOT-23-3:D_SOT-23-3_P; Category: Diodes; Value: BZX84C12-7-F; Manufacturer Part Number: BZX84C12-7-F; ComponentLink1Description: Internal Datasheet; ComponentLink1URL: http://www.diodes.com/datasheets/ds18001.pdf; ComponentLink2Description: External Datasheet; ComponentLink2URL: http://www.diodes.com/datasheets/ds18001.pdf; Supplier 1: Digi-Key; Supplier Part Number 1: BZX84C12-FDICT-ND; SortValue: BZX84C12-7-F; Voltage - Zener (Nom) (Vz): 12V; Power - Max: 300mW; Mounting Type: Surface Mount; Package: TO-236-3- SC-59- SOT-23-3; Supplier Device Package: SOT-23-3; Packaging: Cut Tape (CT); Operating Temperature: -65°C ~ 150°C; JLCPCB Part #: C85186; cad-reference: BZX84C12-7-F
D2 D9 D11 = BZX84B16-7-F: DIODE ZENER 16V 300MW SOT23; Manufacturer: Diodes Inc; CategorySort: 400; Voltage - Forward (Vf) (Max) @ If: 900mV @ 10mA; Current - Reverse Leakage @ Vr: 100nA @ 11.2V; Tolerance: ±2%; Impedance (Max) (Zzt): 40 Ohm; Num Pins: 3; Diode Suffix: 1A_3C; kicad-symbol: Diode:DZ_1A_3C; kicad-footprint: D_SOT-23-3:D_SOT-23-3_P; Category: Diodes; Value: BZX84B16-7-F; Manufacturer Part Number: BZX84B16-7-F; ComponentLink1Description: Internal Datasheet; ComponentLink1URL: http://www.diodes.com/datasheets/BZX84Bxx(x).pdf; ComponentLink2Description: External Datasheet; ComponentLink2URL: http://www.diodes.com/datasheets/BZX84Bxx(x).pdf; Supplier 1: Digi-Key; Supplier Part Number 1: BZX84B16-FDICT-ND; SortValue: BZX84B16-7-F; Voltage - Zener (Nom) (Vz): 16V; Power - Max: 300mW; Mounting Type: Surface Mount; Package: TO-236-3- SC-59- SOT-23-3; Supplier Device Package: SOT-23-3; Packaging: Cut Tape (CT); Operating Temperature: -65°C ~ 150°C; JLCPCB Part #: C968217; cad-reference: BZX84B16-7-F
D3 D6 D7 = BAS16-7-F: DIODE SWITCHING 75V 200MA SOT23; Manufacturer: Diodes Inc; CategorySort: 400; Diode Type: Standard; Voltage - Forward (Vf) (Max) @ If: 1.25V @ 150mA; Speed: Small Signal =< 200mA (Io)- Any Speed; Reverse Recovery Time (trr): 4ns; Current - Reverse Leakage @ Vr: 1µA @ 75V; Capacitance @ Vr- F: 2pF @ 0V- 1MHz; Num Pins: 3; Diode Suffix: 1A_3C; id: 3104; is_external: 1; Category: Diodes; Value: BAS16-7-F; Manufacturer Part Number: BAS16-7-F; ComponentLink1Description: Internal Datasheet; ComponentLink1URL: http://www.diodes.com/datasheets/ds12003.pdf; ComponentLink2Description: External Datasheet; ComponentLink2URL: http://www.diodes.com/datasheets/ds12003.pdf; Supplier 1: Digi-Key; Supplier Part Number 1: BAS16-FDICT-ND; SortValue: BAS16-7-F; Voltage - DC Reverse (Vr) (Max): 75V; Current - Average Rectified (Io): 200mA; Mounting Type: Surface Mount; Package: TO-236-3- SC-59- SOT-23-3; Supplier Device Package: SOT-23-3; Packaging: Cut Tape (CT); JLCPCB Part #: C69162
D4 = PESD1IVN24-AX: TVS DIODE 24VWM 42VC SOD323; Manufacturer: Nexperia; id: 3715; is_external: 1; Manufacturer Part Number: PESD1IVN24-AX; Value: PESD1IVN24-AX; JLCPCB Part #: C503381
D5 D8 D12-D14 = PESD5V0S1BA-115: TVS DIODE 5VWM 14VC SOD323; Manufacturer: Nexperia; id: 3718; is_external: 1; Value: PESD5V0S1BA-115; Manufacturer Part Number: PESD5V0S1BA-115; JLCPCB Part #: C19224
D15 = APT2012SURCK: 0805 Red 630nm LED Indication - Discrete 1.95V 0805 (2012 Metric); Manufacturer: Kingbright; kicad-symbol: LED-RED:LED-RED; kicad-footprint: LED-0805-RED:LED-0805-RED; cad-reference: APT2012SURCK; Manufacturer Part Number: APT2012SURCK; Value: APT2012SURCK
D16 = APT2012CGCK: 0805 Green 570nm LED Indication - Discrete 2.1V 0805 (2012 Metric); Manufacturer: Kingbright; kicad-symbol: LED-GREEN:LED-GREEN; kicad-footprint: LED-0805-GREEN:LED-0805-GREEN; cad-reference: APT2012CGCK; Manufacturer Part Number: APT2012CGCK; Value: APT2012CGCK
J1 J2 = WIREPAD-18AWG-4X-3.5MM: Internal Part Number: nan; Manufacturer: Wavenumber; flags: NO_BOM; cad-reference: WIREPAD-18AWG-4X-3.5MM; Manufacturer Part Number: WIREPAD-18AWG-4X-3.5MM; Value: WIREPAD-18AWG-4X-3.5MM
J3 = WIREPAD-22AWG-6X-3.5MM: Manufacturer: Wavenumber; flags: NO_BOM; cad-reference: WIREPAD-22AWG-6X-3.5MM; Manufacturer Part Number: WIREPAD-22AWG-6X-3.5MM; Value: WIREPAD-22AWG-6X-3.5MM
J4 = WIREPAD-22AWG-4X-3.5MM: Manufacturer: Wavenumber; flags: NO_BOM; cad-reference: WIREPAD-22AWG-4X-3.5MM; Manufacturer Part Number: WIREPAD-22AWG-4X-3.5MM; Value: WIREPAD-22AWG-4X-3.5MM
J5 = WIREPAD-22AWG-3X-3.5MM: Manufacturer: Wavenumber; flags: NO_BOM; cad-reference: WIREPAD-22AWG-3X-3.5MM; Manufacturer Part Number: WIREPAD-22AWG-3X-3.5MM; Value: WIREPAD-22AWG-3X-3.5MM
J6 = WIREPAD-22AWG-2X-3.5MM: Manufacturer: Wavenumber; flags: NO_BOM; cad-reference: WIREPAD-22AWG-2X-3.5MM; Manufacturer Part Number: WIREPAD-22AWG-2X-3.5MM; Value: WIREPAD-22AWG-2X-3.5MM
J7 = TAG-CONNECT-SWD: Tag Connect Pads for ARM SWD Debugging; Manufacturer: Wavenumber; flags: NO_BOM; cad-reference: TAG-CONNECT-SWD; Manufacturer Part Number: TAG-CONNECT-SWD; Value: TAG-CONNECT-SWD
J8 = USB4145-03-0230-C: USB 2.0 TYPE-C RECPT VERT SMT; Manufacturer: GCT; kicad-symbol: USB4145-03-0230-C:USB4145-03-0230-C; Value: USB4145-03-0230-C; Manufacturer Part Number: USB4145-03-0230-C; JLCPCB Part #: C5291559; cad-reference: USB4145-03-0230-C; kicad-footprint: USB4145-03-0230-C:USB4145-03-0230-C
J9 = 20021121-00010T4LF: Connector Header Surface Mount 10 position 0.050" (1.27mm); Manufacturer: Amphenol ICC; id: 2782; is_external: 1; Manufacturer Part Number: 20021121-00010T4LF; Value: 20021121-00010T4LF; JLCPCB Part #: C598540
L1 L3 = MLZ1608M100WTD25: 10uH ±20% 90mA 1.05Ω 0603 Inductors (SMD); Manufacturer: TDK; CategorySort: 300; kicad-symbol: Inductor:Inductor; kicad-footprint: C0603_0.90MM_MD:C0603_0.90MM_MD; Category: Inductors; Value: 10uH; cad-reference: MLZ1608M100WTD25; Manufacturer Part Number: MLZ1608M100WTD25; JLCPCB Part #: C2047264
L2 = LQG15HS15NJ02D: 450mA 15nH ±5% 320mΩ 0402 Inductors (SMD) ROHS; Manufacturer: Murata; CategorySort: 300; kicad-symbol: Inductor:Inductor; kicad-footprint: C0402_0.55MM_MD:C0402_0.55MM_MD; Category: Inductors; Value: 15nH; cad-reference: LQG15HS15NJ02D; Manufacturer Part Number: LQG15HS15NJ02D; JLCPCB Part #: C86059
L4 = CDRH103RNP-6R8NC-B: 3.6A 6.8uH ±30% 3.84A SMD,10.2x10mm Power Inductors ROHS; Manufacturer: Sumida; CategorySort: 300; Inductance (uH): 6.8; DCR Max (Ohms): 35; id: 9209; is_external: 1; Tolerance: 20%; Category: Inductors; Value: 6.8 uH 3.84A; Manufacturer Part Number: CDRH103RNP-6R8NC-B; Sort Value Package: MSS1038_68; Height (mm): 2.8; JLCPCB Part #: C167253
L5 L6 = MPZ2012S221AT000: 40mΩ  3A ±25% 220Ω@100MHz 0805 Ferrite Beads ROHS; Manufacturer: TDK Corporation; CategorySort: 300; kicad-symbol: Inductor:L_2P; kicad-footprint: L_0805:L0805_1.45MM_MD; Category: Inductors; Value: MPZ2012S221AT000; Manufacturer Part Number: MPZ2012S221AT000; JLCPCB Part #: C76818; Tolerance: ±25%; Max Current: 3A; cad-reference: MPZ2012S221AT000
M1-M4 = M2.5: M2.5 screw hole ISO standard 3.1mm clearance 8 conductivity holes 5.25mm pad size; Manufacturer: Wavenumber; id: 4097; is_external: 0; Flags: no-bom; Value: M2.5; Manufacturer Part Number: M2.5; Category: Screw Mount
Q1 Q2 Q7 = BSS84-7-F: MOSFET P-CH 50V 130MA SOT23-3; Manufacturer: Diodes Incorporated; id: 9187; is_external: 1; Value: BSS84-7-F; Manufacturer Part Number: BSS84-7-F; JLCPCB Part #: C85202
Q3 Q4 Q8-Q10 = 2N7002P,215: MOSFET N-CH 60V 0.36A SOT-23; Manufacturer: Nexperia; id: 9174; is_external: 1; Manufacturer Part Number: 2N7002P,215; Value: 2N7002P,215; JLCPCB Part #: C81488
Q5 = BSS138K: N-Channel MOSFET, Logic Level Enhancement Mode, 50V 0.22A, 1.6Ω; Manufacturer: OnSemi; id: 9184; is_external: 1; Manufacturer Part Number: BSS138K; Value: BSS138K; JLCPCB Part #: C255592
Q6 = ZXMP4A16GTA: MOSFET P-CH 40V 6.4A SOT223; Manufacturer: Diodes Incorporated; kicad-symbol: MOSFET-P-CH-1G2D4D3S:MOSFET-P-CH-1G2D4D3S; kicad-footprint: SOT223:SOT223; Value: ZXMP4A16GTA; cad-reference: ZXMP4A16GTA; Manufacturer Part Number: ZXMP4A16GTA; JLCPCB Part #: C141324
R1 R2 R14 R19-R21 R24 R26 R31 R38 = ERJ-3EKF1003V: RES 100K OHM 1/10W 1% 0603 SMD; Manufacturer: Panasonic Electronic Components; Package Power: 0603  (0.1W); Power (Watts): 0.1W- 1/10W; Temperature Coefficient: ±100ppm/°C; Limiting Element Voltage: 75; Maximum Overload Voltage: 150; Maximum Working Voltage: 75.0V; Substitution Notes: 100k , ±1% , 0603 , AEC-Q200; id: 5044; is_external: 1; Value: 100kΩ; Manufacturer Part Number: ERJ-3EKF1003V; Manufacturer 1: Panasonic Electronic Components; Manufacturer Part Number 1: ERJ-3EKF1003V; Category: Resistors; Resistance (Ohms): 100k; Composition: Thick Film; Features: -; Tolerance: ±1%; Package: 0603 (1608 Metric); Supplier Package: 0603; Height: 0.55MM; Number of Terminations: 2; Packaging: Cut Tape (CT); Sort Value: 100000; Sort Value Package: 603_100000; Ratings: AEC-Q200; JLCPCB Part #: C189597
R3 R4 R11 R18 R25 R28 = ERJ-3EKF1002V: RES 10K OHM 1/10W 1% 0603 SMD; Manufacturer: Panasonic Electronic Components; Package Power: 0603  (0.1W); Power (Watts): 0.1W- 1/10W; Temperature Coefficient: ±100ppm/°C; Limiting Element Voltage: 75; Maximum Overload Voltage: 150; Maximum Working Voltage: 31.6V; Substitution Notes: 10k , ±1% , 0603 , AEC-Q200; id: 5025; is_external: 1; Value: 10kΩ; Manufacturer Part Number: ERJ-3EKF1002V; Category: Resistors; Resistance (Ohms): 10k; Composition: Thick Film; Features: -; Tolerance: ±1%; Package: 0603 (1608 Metric); Supplier Package: 0603; Size / Dimension: 0.063" L x 0.031" W (1.60mm x 0.80mm); Height: 0.55MM; Number of Terminations: 2; Packaging: Cut Tape (CT); Sort Value: 10000; Sort Value Package: 603_10000; Ratings: AEC-Q200; JLCPCB Part #: C191124; Manufacturer 1: Panasonic Electronic Components; Manufacturer Part Number 1: ERJ-3EKF1002V
R5 R6 R10 R29 = ERJ-3EKF1004V: RES 1M OHM 1/10W 1% 0603 SMD; Manufacturer: Panasonic Electronic Components; Package Power: 0603  (0.1W); Power (Watts): 0.1W- 1/10W; Temperature Coefficient: ±100ppm/°C; Limiting Element Voltage: 75; Maximum Overload Voltage: 150; Maximum Working Voltage: 75.0V; Substitution Notes: 1M , ±1% , 0603 , AEC-Q200; id: 5045; is_external: 1; Value: 1MΩ; Manufacturer Part Number: ERJ-3EKF1004V; JLCPCB Part #: C105578; Manufacturer 1: Panasonic Electronic Components; Manufacturer Part Number 1: ERJ-3EKF1004V; Category: Resistors; Resistance (Ohms): 1M; Composition: Thick Film; Features: -; Tolerance: ±1%; Package: 0603 (1608 Metric); Supplier Package: 0603; Height: 0.55MM; Number of Terminations: 2; Packaging: Cut Tape (CT); Sort Value: 1000000; Sort Value Package: 603_1000000; Ratings: AEC-Q200
R7 = ERJ-3EKF1001V: RES 1K OHM 1/10W 1% 0603 SMD; Manufacturer: Panasonic Electronic Components; Package Power: 0603  (0.1W); Power (Watts): 0.1W- 1/10W; Temperature Coefficient: ±100ppm/°C; Limiting Element Voltage: 75; Maximum Overload Voltage: 150; Maximum Working Voltage: 10.0V; Substitution Notes: 1k , ±1% , 0603 , AEC-Q200; id: 5024; is_external: 1; Value: 1kΩ; Manufacturer Part Number: ERJ-3EKF1001V; JLCPCB Part #: C118155; Manufacturer 1: Panasonic Electronic Components; Manufacturer Part Number 1: ERJ-3EKF1001V; Category: Resistors; Resistance (Ohms): 1k; Composition: Thick Film; Features: -; Tolerance: ±1%; Package: 0603 (1608 Metric); Supplier Package: 0603; Size / Dimension: 0.063" L x 0.031" W (1.60mm x 0.80mm); Height: 0.55MM; Number of Terminations: 2; Packaging: Cut Tape (CT); Sort Value: 1000; Sort Value Package: 603_1000; Ratings: AEC-Q200
R8 R33 = ERJ-3EKF1003V: RES 100K OHM 1/10W 1% 0603 SMD; Manufacturer: Panasonic Electronic Components; Package Power: 0603  (0.1W); Power (Watts): 0.1W- 1/10W; Temperature Coefficient: ±100ppm/°C; Limiting Element Voltage: 75; Maximum Overload Voltage: 150; Maximum Working Voltage: 75.0V; Substitution Notes: 100k , ±1% , 0603 , AEC-Q200; id: 5026; is_external: 1; Value: 100kΩ; Manufacturer Part Number: ERJ-3EKF1003V; JLCPCB Part #: C189597; Manufacturer 1: Panasonic Electronic Components; Manufacturer Part Number 1: ERJ-3EKF1003V; Category: Resistors; Resistance (Ohms): 100k; Composition: Thick Film; Features: -; Tolerance: ±1%; Package: 0603 (1608 Metric); Supplier Package: 0603; Size / Dimension: 0.063" L x 0.031" W (1.60mm x 0.80mm); Height: 0.55MM; Number of Terminations: 2; Packaging: Cut Tape (CT); Sort Value: 100000; Sort Value Package: 603_100000; Ratings: AEC-Q200
  R33: ComponentLink1Description: Internal Datasheet; ComponentLink1URL: datasheets\Panasonic Electronic Components\AOA0000CE2.pdf; ComponentLink2Description: External Datasheet; ComponentLink2URL: http://industrial.panasonic.com/www-data/pdf/AOA0000/AOA0000CE2.pdf; Supplier 1: Digi-Key; Supplier Part Number 1: P100KHCT-ND
R9 R12 R27 R30 R32 = ERJ-3EKF1000V: RES 100 OHM 1/10W 1% 0603 SMD; Manufacturer: Panasonic Electronic Components; Package Power: 0603  (0.1W); Resistance (Ohms): 100; Power (Watts): 0.1W- 1/10W; Temperature Coefficient: ±100ppm/°C; Limiting Element Voltage: 75; Maximum Overload Voltage: 150; Maximum Working Voltage: 3.2V; Substitution Notes: 100 , ±1% , 0603 , AEC-Q200; id: 5023; is_external: 1; Value: 100Ω; Manufacturer Part Number: ERJ-3EKF1000V; ComponentLink1Description: Internal Datasheet; ComponentLink1URL: datasheets\Panasonic Electronic Components\AOA0000CE2.pdf; ComponentLink2Description: External Datasheet; ComponentLink2URL: http://industrial.panasonic.com/www-data/pdf/AOA0000/AOA0000CE2.pdf; Supplier 1: Digi-Key; Supplier Part Number 1: P100HCT-ND; Category: Resistors; Composition: Thick Film; Features: -; Tolerance: ±1%; Package: 0603 (1608 Metric); Supplier Package: 0603; Size / Dimension: 0.063" L x 0.031" W (1.60mm x 0.80mm); Height: 0.55MM; Number of Terminations: 2; Packaging: Cut Tape (CT); Sort Value: 100; Sort Value Package: 603_100; Ratings: AEC-Q200; JLCPCB Part #: C193336; Manufacturer 1: Panasonic Electronic Components; Manufacturer Part Number 1: ERJ-3EKF1000V
R13 = ERJ-6GEY0R00V: RES 0.0 OHM 1/8W JUMP 0805 SMD; Manufacturer: Panasonic Electronic Components; Package Power: 0805  (0.125W); Resistance (Ohms): 0; Power (Watts): 0.125W- 1/8W; Tolerance: Jumper; Limiting Element Voltage: 150; Maximum Overload Voltage: 200; Maximum Working Voltage: 0.0V; Substitution Notes: 0 , Jumper , 0805 , AEC-Q200; kicad-symbol: Resistor:R_2P; kicad-footprint: R0805_0.70MM_HD:R0805_0.70MM_HD; Value: 0Ω; Manufacturer Part Number: ERJ-6GEY0R00V; JLCPCB Part #: C96345; Manufacturer 1: Panasonic Electronic Components; Manufacturer Part Number 1: ERJ-6GEY0R00V; Supplier 1: Digi-Key; Supplier Part Number 1: P0.0ACT-ND; Category: Resistors; Composition: Thick Film; Features: -; Temperature Coefficient: -; Package: 0805 (2012 Metric); Supplier Package: 805; Height: 0.70MM; Number of Terminations: 2; Sort Value: 0; Sort Value Package: 805_0; Ratings: AEC-Q200; cad-reference: ERJ-6GEY0R00V
R15 R16 = ERJ-6GEY0R00V: RES 0.0 OHM 1/8W JUMP 0805 SMD; Manufacturer: Panasonic Electronic Components; Package Power: 0805  (0.125W); kicad-symbol: Resistor:R_2P; kicad-footprint: R0805_0.70MM_HD:R0805_0.70MM_HD; Resistance (Ohms): 0; Power (Watts): 0.125W- 1/8W; Tolerance: Jumper; Limiting Element Voltage: 150; Maximum Overload Voltage: 200; Maximum Working Voltage: 0.0V; Substitution Notes: 0 , Jumper , 0805 , AEC-Q200; Value: 0Ω; cad-reference: ERJ-6GEY0R00V; Manufacturer Part Number: ERJ-6GEY0R00V; JLCPCB Part #: C96345; Manufacturer 1: Panasonic Electronic Components; Manufacturer Part Number 1: ERJ-6GEY0R00V; Supplier 1: Digi-Key; Supplier Part Number 1: P0.0ACT-ND; Category: Resistors; Composition: Thick Film; Features: -; Temperature Coefficient: -; Package: 0805 (2012 Metric); Supplier Package: 805; Height: 0.70MM; Number of Terminations: 2; Sort Value: 0; Sort Value Package: 805_0; Ratings: AEC-Q200
R17 = ERJ-3EKF5233V: RES 523K OHM 1/10W 1% 0603 SMD; Manufacturer: Panasonic Electronic Components; Package Power: 0603  (0.1W); Power (Watts): 0.1W- 1/10W; Temperature Coefficient: ±100ppm/°C; Limiting Element Voltage: 75; Maximum Overload Voltage: 150; Maximum Working Voltage: 75.0V; Substitution Notes: 523k , ±1% , 0603 , AEC-Q200; id: 5445; is_external: 1; Value: 523kΩ; Manufacturer Part Number: ERJ-3EKF5233V; Category: Resistors; Resistance (Ohms): 523k; Composition: Thick Film; Features: -; Tolerance: ±1%; Package: 0603 (1608 Metric); Supplier Package: 0603; Height: 0.55MM; Number of Terminations: 2; Packaging: Cut Tape (CT); Sort Value: 523000; Sort Value Package: 603_523000; Ratings: AEC-Q200; Manufacturer Part Number 1: ERJ-3EKF5233V; Manufacturer 1: Panasonic Electronic Components; JLCPCB Part #: C185324
R22 = ERJ-3EKF4992V: RES 49.9K OHM 1/10W 1% 0603 SMD; Manufacturer: Panasonic Electronic Components; Package Power: 0603  (0.1W); Power (Watts): 0.1W- 1/10W; Temperature Coefficient: ±100ppm/°C; Limiting Element Voltage: 75; Maximum Overload Voltage: 150; Maximum Working Voltage: 70.6V; Substitution Notes: 49.9k , ±1% , 0603 , AEC-Q200; id: 5429; is_external: 1; Value: 49.9kΩ; Manufacturer Part Number: ERJ-3EKF4992V; Category: Resistors; Resistance (Ohms): 49.9k; Composition: Thick Film; Features: -; Tolerance: ±1%; Package: 0603 (1608 Metric); Supplier Package: 0603; Height: 0.55MM; Number of Terminations: 2; Packaging: Cut Tape (CT); Sort Value: 49900; Sort Value Package: 603_49900; Ratings: AEC-Q200; Manufacturer 1: Panasonic Electronic Components; Manufacturer Part Number 1: ERJ-3EKF4992V; JLCPCB Part #: ERJ3EKF4992V
R23 = ERJ-3EKF1003V: RES 100K OHM 1/10W 1% 0603 SMD; Manufacturer: Panasonic Electronic Components; Value: 100kΩ; Package Power: 0603  (0.1W); Power (Watts): 0.1W- 1/10W; Temperature Coefficient: ±100ppm/°C; Limiting Element Voltage: 75; Maximum Overload Voltage: 150; Maximum Working Voltage: 75.0V; Substitution Notes: 100k , ±1% , 0603 , AEC-Q200; id: 5026; is_external: 1; Manufacturer Part Number: ERJ-3EKF1003V; ComponentLink1Description: Internal Datasheet; ComponentLink1URL: datasheets\Panasonic Electronic Components\AOA0000CE2.pdf; ComponentLink2Description: External Datasheet; ComponentLink2URL: http://industrial.panasonic.com/www-data/pdf/AOA0000/AOA0000CE2.pdf; Supplier 1: Digi-Key; Supplier Part Number 1: P100KHCT-ND; Category: Resistors; Resistance (Ohms): 100k; Composition: Thick Film; Features: -; Tolerance: ±1%; Package: 0603 (1608 Metric); Supplier Package: 0603; Size / Dimension: 0.063" L x 0.031" W (1.60mm x 0.80mm); Height: 0.55MM; Number of Terminations: 2; Packaging: Cut Tape (CT); Sort Value: 100000; Sort Value Package: 603_100000; Ratings: AEC-Q200; JLCPCB Part #: C189597; Manufacturer 1: Panasonic Electronic Components; Manufacturer Part Number 1: ERJ-3EKF1003V
R34 R35 = ERJ-3EKF3300V: RES 330 OHM 1/10W 1% 0603 SMD; Manufacturer: Panasonic Electronic Components; Package Power: 0603  (0.1W); kicad-symbol: Resistor:R_2P; kicad-footprint: R0603_0.55MM_HD:R0603_0.55MM_HD; Resistance (Ohms): 330; Power (Watts): 0.1W- 1/10W; Temperature Coefficient: ±100ppm/°C; Limiting Element Voltage: 75; Maximum Overload Voltage: 150; Maximum Working Voltage: 5.7V; Substitution Notes: 330 , ±1% , 0603 , AEC-Q200; Value: 330Ω; cad-reference: ERJ-3EKF3300V; Manufacturer Part Number: ERJ-3EKF3300V; Manufacturer 1: Panasonic Electronic Components; Manufacturer Part Number 1: ERJ-3EKF3300V; Category: Resistors; Composition: Thick Film; Features: -; Tolerance: ±1%; Package: 0603 (1608 Metric); Supplier Package: 603; Height: 0.55MM; Number of Terminations: 2; Packaging: Cut Tape (CT); Sort Value: 330.0; Sort Value Package: 603_330; Ratings: AEC-Q200
R36 R37 = ERJ-3EKF5101V: RES 5.1K OHM 1/10W 1% 0603 SMD; Manufacturer: Panasonic Electronic Components; Package Power: 0603  (0.1W); Power (Watts): 0.1W- 1/10W; Temperature Coefficient: ±100ppm/°C; Limiting Element Voltage: 75; Maximum Overload Voltage: 150; Maximum Working Voltage: 22.6V; Substitution Notes: 5.1k , ±1% , 0603 , AEC-Q200; id: 5433; is_external: 1; Value: 5.1kΩ; Manufacturer Part Number: ERJ-3EKF5101V; Category: Resistors; Resistance (Ohms): 5.1k; Composition: Thick Film; Features: -; Tolerance: ±1%; Package: 0603 (1608 Metric); Supplier Package: 0603; Height: 0.55MM; Number of Terminations: 2; Packaging: Cut Tape (CT); Sort Value: 5100; Sort Value Package: 603_5100; Ratings: AEC-Q200; JLCPCB Part #: C123727; Manufacturer Part Number 1: ERJ-3EKF5101V; Manufacturer 1: Panasonic Electronic Components
TP1-TP27 = SMT_TP-1MM: Manufacturer: Wavenumber; kicad-symbol: SMT_TEST:SMT_TEST; kicad-footprint: SMT_TP-1MM:SMT_TP-1MM; flags: NO_BOM; cad-reference: SMT_TP-1MM; Manufacturer Part Number: SMT_TP-1MM; Value: SMT Testpoint 1MM
U1 U8 = AP22804AW5-7: 2.7V~5.5V 50mΩ 2.5A 1 SOT-25  Power Distribution Switches ROHS; Manufacturer: Diodes Incorporated; cad-reference: AP22804AW5-7; Manufacturer Part Number: AP22804AW5-7; JLCPCB Part #: C3001659; Value: AP22804AW5-7
U2 = TJA1021T/20/CM,118: 1 Transceiver Full Duplex 1 SOIC-8 LIN Transceivers ROHS; Manufacturer: NXP; id: 3710; is_external: 1; Value: TJA1021T/20/CM,118; Manufacturer Part Number: TJA1021T/20/CM,118; JLCPCB Part #: C128810
U3 U4 U9 U10 = SN74LV1T34DBVR: Buffer, Non-Inverting 1 Element 1 Bit per Element Push-Pull Output SOT-23-5; Manufacturer: Texas Instruments; Flags: NAN; Manufacturer Part Number: SN74LV1T34DBVR; JLCPCB Part #: C100024; Value: SN74LV1T34DBVR; Internal Part Number: NAN
U5 = NRF52840-QIAA-R: Cortex M4 MCU IC RF TXRX+MCU 802.15.4 73QFN; Manufacturer: Nordic; Manufacturer Part Number: NRF52840-QIAA-R; Value: NRF52840-QIAA-R; JLCPCB Part #: C190794
U7 = AP64352SP-13: 3.8V to 40V Input, 3.5A Low IQ Synchronous Buck Converter; Manufacturer: Diodes Inc; kicad-symbol: AP64352SP-13:AP64352SP-13; kicad-footprint: SO8-EP:SO8-EP; table: regulator_switching; cad-reference: AP64352SP-13; Manufacturer Part Number: AP64352SP-13; JLCPCB Part #: C2071665; Value: AP64352SP-13; category: ic
U11 = TLV271CW5-7: Single 1pA 2V/us 1.9MHz SOT-25 Operational Amplifier ROHS; Manufacturer: Diodes Inc; id: 3706; is_external: 1; Manufacturer Part Number: TLV271CW5-7; Value: TLV271CW5-7; JLCPCB Part #: C150498
U12 = MX25R6435FZNIL0: Ultra low power, 64M-bit, serial multi I/O flash memory; Manufacturer: Macronix; Manufacturer Part Number: MX25R6435FZNIL0; Value: MX25R6435FZNIL0; JLCPCB Part #: C2802849
U13 = FM25L16B-GTR: 16Kbit 20MHz SPI SOIC-8 FRAM ROHS; Internal Part Number: nan; Manufacturer: Infineon Technologies; kicad-symbol: FM25-FRAM:FM25-FRAM; kicad-footprint: SOIC 8:SOIC 8; Value: FM25L16B-GTR; cad-reference: FM25L16B-GTR; Manufacturer Part Number: FM25L16B-GTR; JLCPCB Part #: C466849; fram#csv.Flags_1: nan
U14 = MAX98357AETE+T: Monaural 3.2Wx2@4O TQFN-16-EP(3x3) Audio Amplifiers ROHS; Manufacturer: Maxim; id: 9195; is_external: 1; Manufacturer Part Number: MAX98357AETE+T; Availability: Unavailable; SnapEDA_Link: https://www.snapeda.com/parts/MAX98357AETE%2BT/Maxim%20Integrated/view-part/48842/?ref=snap; Package: TQFN-16 Maxim; Price: None; Value: MAX98357AETE+T; JLCPCB Part #: C910544
U15 = PRTR5V0U2X,215: 6V Unidirectional 5.5V SOT-143 ESD and Surge Protection (TVS/ESD) ROHS; Manufacturer: Nexperia; id: 3714; is_external: 1; Manufacturer Part Number: PRTR5V0U2X,215; Value: PRTR5V0U2X,215; JLCPCB Part #: C12333
X1 = ECS-320-8-37B-CKY-TR: 32MHz 8pF ±10ppm SMD2016-4P; Manufacturer: ECS; Package Power: PACKAGE (POWER); kicad-symbol: Crystal:CRYSTAL-4P--1-3; kicad-footprint: XTAL_2016:XTAL_2016; Value: 32MHz; cad-reference: ECS-320-8-37B-CKY-TR; Manufacturer Part Number: ECS-320-8-37B-CKY-TR; JLCPCB Part #: C2636238; Category: crystals/smt
X2 = NX3215SA-32.768K-STD-MUA-9: 32.768kHz 9pF ±20ppm SMD3215-2P; Manufacturer: NDK; Package Power: PACKAGE (POWER); kicad-symbol: Crystal:CRYSTAL-2P--1-2; kicad-footprint: XTAL_3215:XTAL_3215; Value: 32KHz; cad-reference: NX3215SA-32.768K-STD-MUA-9; Manufacturer Part Number: NX3215SA-32.768K-STD-MUA-9; JLCPCB Part #: C519280; Category: crystals/smt